# Altium schematic sheet ETH-PHY.SchDoc
size A4; SheetNumber: 7; SheetTotal: 9
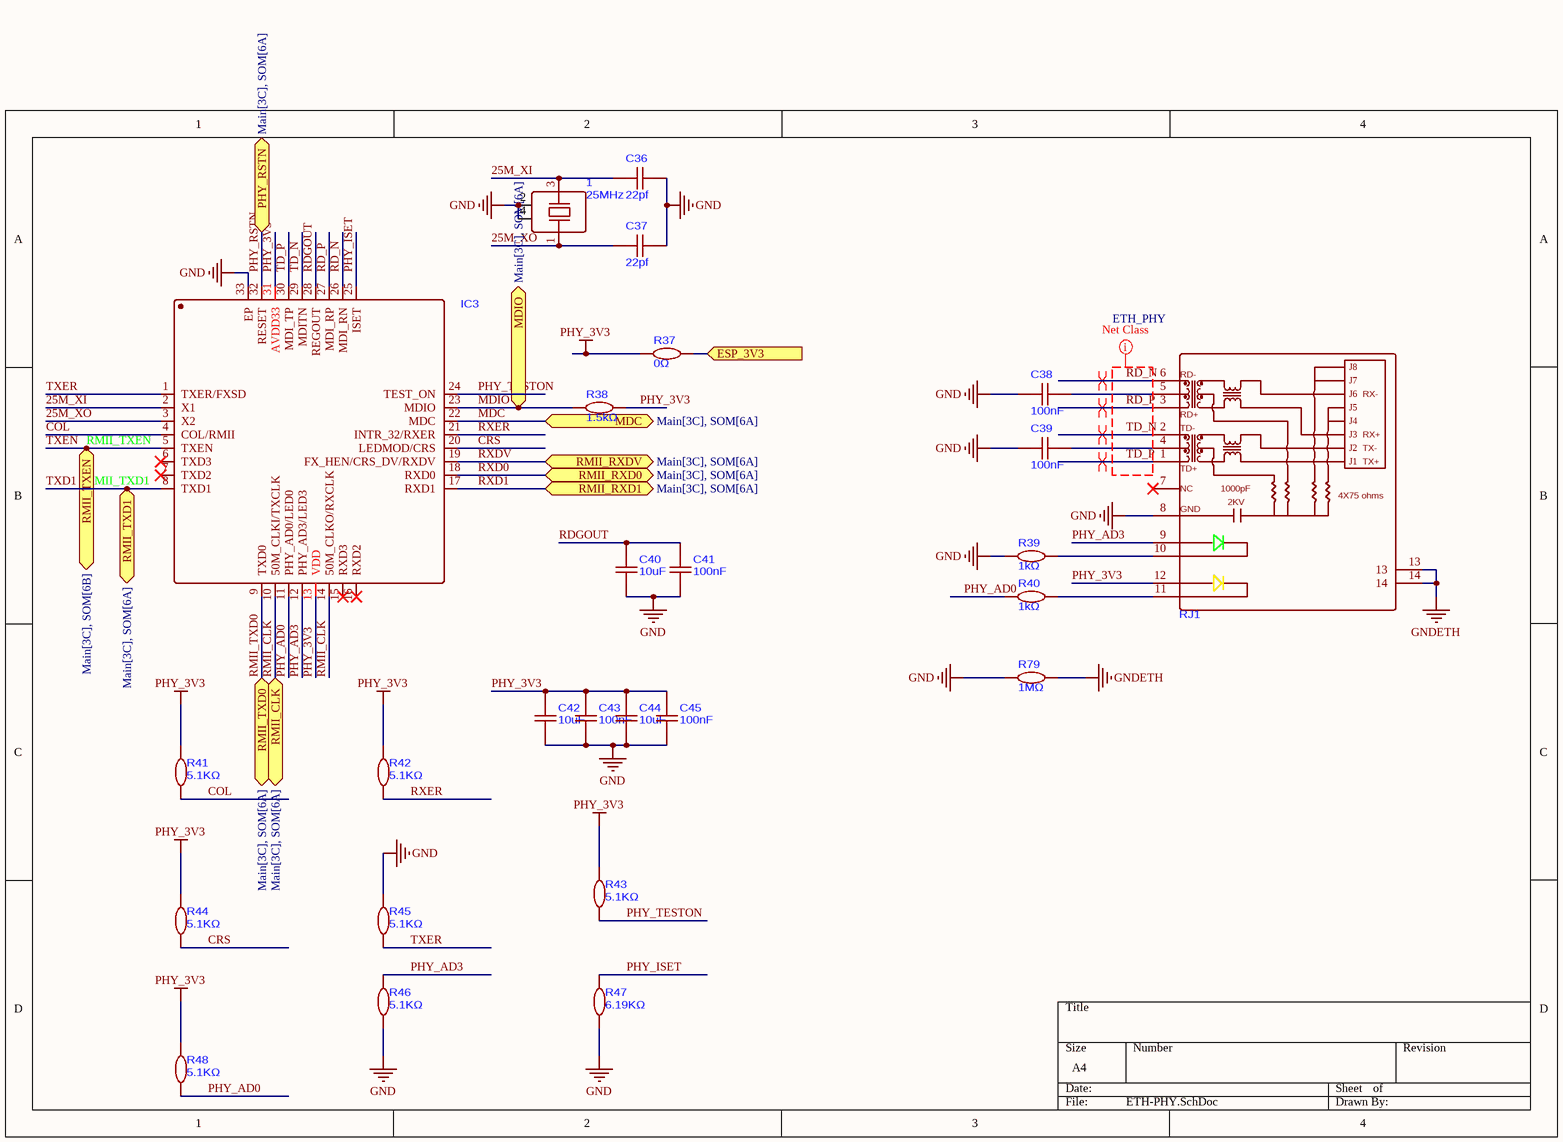
[diagram p0: ETH-PHY.SchDoc]

## Parts
1  25MHz  [CRYSTAL-SMD_4P-L3.2-W2.5-BL]
C36  22pf  [C0603]
C37  22pf  [C0603]
C38  100nF  [C0603]
C39  100nF  [C0603]
C40  10uF  [C0603]
C41  100nF  [C0603]
C42  10uF  [C0603]
C43  100nF  [C0603]
C44  10uF  [C0603]
C45  100nF  [C0603]
IC3  Single Port Fast Ethernet Transceiver  [QFN-32_L4.0-W4.0-P0.40-BL-EP2.7]  (value not drawn)
R37  0Ω  [R0603]
R38  1.5kΩ  [R0603]
R39  1kΩ  [R0603]
R40  1kΩ  [R0603]
R41  5.1KΩ  [R0603]
R42  5.1KΩ  [R0603]
R43  5.1KΩ  [R0603]
R44  5.1KΩ  [R0603]
R45  5.1KΩ  [R0603]
R46  5.1KΩ  [R0603]
R47  6.19KΩ  [R0603]
R48  5.1KΩ  [R0603]
R79  1MΩ  [R2010]
RJ1  CONN MOD JACK RJ45 TH  [RJ45-TH_HR913550A]  (value not drawn)

## Ports
ESP_3V3 (in, see Main[4C], DSI&CSI CONNECTOR[3C], interfaceUART&I2C[1C], Power[3C], SOM[6B]), MDC (bidir, see Main[3C], SOM[6A]), MDIO (bidir, see Main[3C], SOM[6A]), PHY_RSTN (bidir, see Main[3C], SOM[6A]), RMII_CLK (bidir, see Main[3C], SOM[6A]), RMII_RXD0 (bidir, see Main[3C], SOM[6A]), RMII_RXD1 (bidir, see Main[3C], SOM[6A]), RMII_RXDV (bidir, see Main[3C], SOM[6A]), RMII_TXD0 (bidir, see Main[3C], SOM[6A]), RMII_TXD1 (bidir, see Main[3C], SOM[6A]), RMII_TXEN (bidir, see Main[3C], SOM[6B])

## Nets
GND: 1.2(GND) 1.4(GND) C36.2 C37.2 C38.1 C39.1 C40.1 C41.1 C42.1 C43.1 C44.1 C45.1 IC3.33(EP) R39.1 R45.2 R46.2 R47.1 R79.1 RJ1.8(GND)
GNDETH: R79.2 RJ1.13 RJ1.14
PHY_3V3: C42.2 C43.2 C44.2 C45.2 IC3.13(VDD) IC3.31(AVDD33) R37.1 R38.2 R41.2 R42.2 R43.2 R44.2 R48.2 RJ1.12
25M_XI: 1.3(OSC2) C36.1 IC3.2(X1)
25M_XO: 1.1(OSC1) C37.1 IC3.3(X2)
COL: IC3.4(COL/RMII) R41.1
CRS: IC3.20(LEDMOD/CRS) R44.1
ESP_3V3: R37.2 ; port ESP_3V3
MDC: IC3.22(MDC) ; port MDC
MDIO: IC3.23(MDIO) R38.1 ; port MDIO
PHY_AD0: IC3.11(PHY_AD0/LED0) R40.1 R48.1
PHY_AD3: IC3.12(PHY_AD3/LED3) R46.1 RJ1.9
PHY_ISET: IC3.25(ISET) R47.2
PHY_RSTN: IC3.32(RESET) ; port PHY_RSTN
PHY_TESTON: IC3.24(TEST_ON) R43.1
RD_N: IC3.26(MDI_RN) RJ1.6
RD_P: IC3.27(MDI_RP) RJ1.3
RDGOUT: C40.2 C41.2 IC3.28(REGOUT)
RMII_CLK: IC3.10(50M_CLKI/TXCLK) IC3.14(50M_CLKO/RXCLK) ; port RMII_CLK
RMII_TXD0: IC3.9(TXD0) ; port RMII_TXD0
RMII_TXD1: IC3.8(TXD1) ; port RMII_TXD1  [also labelled TXD1]
RMII_TXEN: IC3.5(TXEN) ; port RMII_TXEN  [also labelled TXEN]
RXD0: IC3.18(RXD0) ; port RMII_RXD0
RXD1: IC3.17(RXD1) ; port RMII_RXD1
RXDV: IC3.19(FX_HEN/CRS_DV/RXDV) ; port RMII_RXDV
RXER: IC3.21(INTR_32/RXER) R42.1
TD_N: IC3.29(MDITN) RJ1.2
TD_P: IC3.30(MDI_TP) RJ1.1
TXER: IC3.1(TXER/FXSD) R45.1
NetC38_2: C38.2 RJ1.5
NetC39_2: C39.2 RJ1.4
NetR39_2: R39.2 RJ1.10
NetR40_2: R40.2 RJ1.11

Not connected (* = marked no-connect by the designer): IC3 6(TXD3)* 7(TXD2)* 15(RXD3)* 16(RXD2)*; RJ1 7(NC)*

## Layout directives
net class ETH_PHY: RD_N, RD_P, TD_N, TD_P
differential pair; net class DIFF100; differential pair class DIFF100: RD_N, RD_P, TD_N, TD_P

## Notes on the sheet
- (in symbol HR913550A) J8; RD-; J7; J6; RX-; J5; RD+; J4; TD-; J3; RX+; J2; TX-; J1; TX+; TD+; 1000pF; 4X75 ohms; 2KV

## Library data of the parts
1 = X322525MOB4SI
C36 C37 = CL10C220JB8NNNC: 50V 22pF C0G ±5% 0603 Ceramic Capacitors RoHS
C38 C39 C41 C43 C45 = CC0603KRX7R9BB104: 50V 100nF X7R ±10% 0603 Ceramic Capacitors ROHS
C40 C42 C44 = CL10A106MA8NRNC: 25V 10uF X5R ±20% 0603 Ceramic Capacitors ROHS
IC3 = IP101GRI: Ethernet Transceiver 3.3V QFN-32-EP(4x4) Drivers, Receivers, Transceivers RoHS
R37 = RC0603JR-070RL: 100mW 0Ω 75V Thick Film Resistor ±5% 0603 Chip Resistor - Surface Mount RoHS
R38 = RC0603FR-071K5L: 100mW 1.5kΩ 75V ±100ppm/℃ Thick Film Resistor ±1% 0603 Chip Resistor - Surface Mount RoHS
R39 R40 = RMC 0603 1K J N: 100mW 1kΩ 50V ±100ppm/℃ Thick Film Resistor ±5% 0603 Chip Resistor - Surface Mount ROHS
R41-R46 R48 = FRC0603F5101TS: 100mW 5.1kΩ 75V ±100ppm/℃ Thick Film Resistor ±1% 0603 Chip Resistor - Surface Mount RoHS
R47 = AC0603FR-076K19L: 6.19kΩ 100mW 75V ±100ppm/℃ Thick Film Resistor ±1% 0603 Chip Resistor - Surface Mount RoHS
R79 = RC0603FR-071ML: 100mW 1MΩ 75V Thick Film Resistor ±100ppm/℃ ±1% 0603 Chip Resistor - Surface Mount RoHS
RJ1 = HR913550A: 1 With LED Through Hole Modular/Ethernet Connector Jacks With Magnetics RoHS